# Altium schematic sheet Rail_2.SchDoc: Half Bridge 2
size A4; DocumentNumber: 4; Revision: 1.1; SheetNumber: 4; SheetTotal: 6
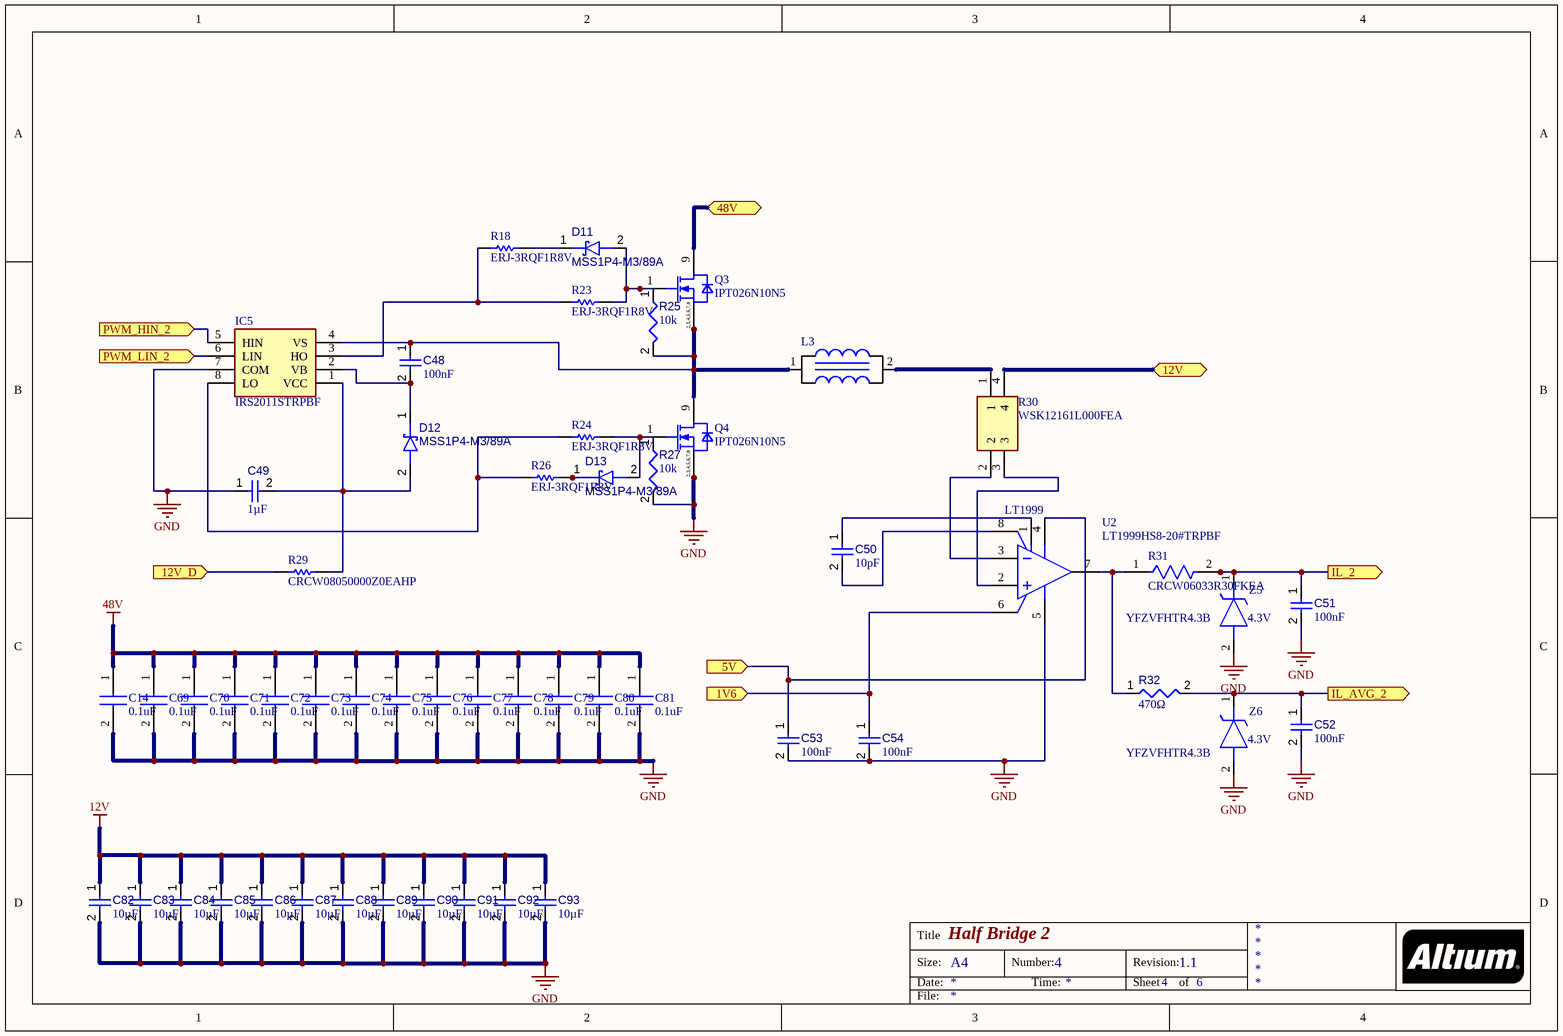
[diagram p0: Rail_2.SchDoc]

## Parts
C14  0.1uF  [CAPC1608X90N]
C48  value 100nF  [CAPC1608X90X40ML10T20]  (hidden comment: Capacitor 100 nF +/-10% 50 V 0603)
C49  value 1µF  [CAPC0603(1608)100_L]  (hidden comment: Capacitor 1µF +/-0.1% 25V 0603)
C50  value 10pF  [CAPC1608X87X35ML15T15]  (hidden comment: Capacitor 10 pF +/- 0.25 pF 50 V 0603)
C51  value 100nF  [CAPC1608X90X40ML10T20]  (hidden comment: Capacitor 100 nF +/-10% 50 V 0603)
C52  value 100nF  [CAPC1608X90X40ML10T20]  (hidden comment: Capacitor 100 nF +/-10% 50 V 0603)
C53  value 100nF  [CAPC1608X90X40ML10T20]  (hidden comment: Capacitor 100 nF +/-10% 50 V 0603)
C54  value 100nF  [CAPC1608X90X40ML10T20]  (hidden comment: Capacitor 100 nF +/-10% 50 V 0603)
C69  0.1uF  [CAPC1608X90N]
C70  0.1uF  [CAPC1608X90N]
C71  0.1uF  [CAPC1608X90N]
C72  0.1uF  [CAPC1608X90N]
C73  0.1uF  [CAPC1608X90N]
C74  0.1uF  [CAPC1608X90N]
C75  0.1uF  [CAPC1608X90N]
C76  0.1uF  [CAPC1608X90N]
C77  0.1uF  [CAPC1608X90N]
C78  0.1uF  [CAPC1608X90N]
C79  0.1uF  [CAPC1608X90N]
C80  0.1uF  [CAPC1608X90N]
C81  0.1uF  [CAPC1608X90N]
C82  value 10µF  [CAPC0805(2012)145_L]  (hidden comment: Capacitor 10µF +/-20% 25V 0805)
C83  value 10µF  [CAPC0805(2012)145_L]  (hidden comment: Capacitor 10µF +/-20% 25V 0805)
C84  value 10µF  [CAPC0805(2012)145_L]  (hidden comment: Capacitor 10µF +/-20% 25V 0805)
C85  value 10µF  [CAPC0805(2012)145_L]  (hidden comment: Capacitor 10µF +/-20% 25V 0805)
C86  value 10µF  [CAPC0805(2012)145_L]  (hidden comment: Capacitor 10µF +/-20% 25V 0805)
C87  value 10µF  [CAPC0805(2012)145_L]  (hidden comment: Capacitor 10µF +/-20% 25V 0805)
C88  value 10µF  [CAPC0805(2012)145_L]  (hidden comment: Capacitor 10µF +/-20% 25V 0805)
C89  value 10µF  [CAPC0805(2012)145_L]  (hidden comment: Capacitor 10µF +/-20% 25V 0805)
C90  value 10µF  [CAPC0805(2012)145_L]  (hidden comment: Capacitor 10µF +/-20% 25V 0805)
C91  value 10µF  [CAPC0805(2012)145_L]  (hidden comment: Capacitor 10µF +/-20% 25V 0805)
C92  value 10µF  [CAPC0805(2012)145_L]  (hidden comment: Capacitor 10µF +/-20% 25V 0805)
C93  value 10µF  [CAPC0805(2012)145_L]  (hidden comment: Capacitor 10µF +/-20% 25V 0805)
D11  MSS1P4-M3/89A  [MicroSMP (DO-219AD)]
D12  MSS1P4-M3/89A  [MicroSMP (DO-219AD)]
D13  MSS1P4-M3/89A  [MicroSMP (DO-219AD)]
IC5  IRS2011STRPBF  [SOIC127P600X175-8N-12-V]
L3  Inductor (Ansys)  [Inductor-Footprint-1]  (value not drawn)
Q3  IPT026N10N5  [INF-PG-HSOF-8-1-0-V]
Q4  IPT026N10N5  [INF-PG-HSOF-8-1-0-V]
R18  ERJ-3RQF1R8V  [RESC1608X55X30LL15T15]
R23  ERJ-3RQF1R8V  [RESC1608X55X30LL15T15]
R24  ERJ-3RQF1R8V  [RESC1608X55X30LL15T15]
R25  value 10k  [RESC1608X55X25ML10T15]  (hidden comment: Resistor 10k +/-1% 0603 100 mW)
R26  ERJ-3RQF1R8V  [RESC1608X55X30LL15T15]
R27  value 10k  [RESC1608X55X25ML10T15]  (hidden comment: Resistor 10k +/-1% 0603 100 mW)
R29  CRCW08050000Z0EAHP  [RESC2013X50X30ML20T20]
R30  WSK12161L000FEA  [WSK12161L000FEA]
R31  CRCW06033R30FKEA  [FP-CRCW0603-e3-IPC_C]
R32  value 470Ω  [RESC0805(2012)_L]  (hidden comment: 470R5J)
U2  LT1999HS8-20#TRPBF  [LT-S8-8_L]
Z5  YFZVFHTR4.3B  [YFZVFHTR43B]
Z6  YFZVFHTR4.3B  [YFZVFHTR43B]

## Ports
1V6 (in), 5V (in), 12V (bidir), 12V_D (in), 48V (bidir), IL_2 (out), IL_AVG_2 (out), PWM_HIN_2 (in), PWM_LIN_2 (in)

## Nets
12V: C82.1 C83.1 C84.1 C85.1 C86.1 C87.1 C88.1 C89.1 C90.1 C91.1 C92.1 C93.1
48V: C14.1 C69.1 C70.1 C71.1 C72.1 C73.1 C74.1 C75.1 C76.1 C77.1 C78.1 C79.1 C80.1 C81.1
GND: C14.2 C49.1 C51.2 C52.2 C53.2 C54.2 C69.2 C70.2 C71.2 C72.2 C73.2 C74.2 C75.2 C76.2 C77.2 C78.2 C79.2 C80.2 C81.2 C82.2 C83.2 C84.2 C85.2 C86.2 C87.2 C88.2 C89.2 C90.2 C91.2 C92.2 C93.2 IC5.7(COM) Q4.2(SOURCE) Q4.3(SOURCE) Q4.4(SOURCE) Q4.5(SOURCE) Q4.6(SOURCE) Q4.7(SOURCE) Q4.8(SOURCE) R27.2 U2.5(GND) Z5.2(A) Z6.2(A)
1V6: C54.1 U2.6(REF) ; port 1V6
5V: C53.1 U2.4(V+) ; port 5V
12V: R30.4 ; port 12V  [a separate net that carries the same name]
12V_D: R29.1 ; port 12V_D
48V: Q3.9(DRAIN) ; port 48V  [a separate net that carries the same name]
IL_2: C51.1 R31.2 Z5.1(K) ; port IL_2
IL_AVG_2: C52.1 R32.2 Z6.1(K) ; port IL_AVG_2
PWM_HIN_2: IC5.5(HIN) ; port PWM_HIN_2
PWM_LIN_2: IC5.6(LIN) ; port PWM_LIN_2
NetC48_1: C48.1 IC5.4(VS) L3.1 Q3.2(SOURCE) Q3.3(SOURCE) Q3.4(SOURCE) Q3.5(SOURCE) Q3.6(SOURCE) Q3.7(SOURCE) Q3.8(SOURCE) Q4.9(DRAIN) R25.2
NetC48_2: C48.2 D12.1(K) IC5.2(VB)
NetC49_2: C49.2 D12.2(A) IC5.1(VCC) R29.2
NetC50_1: C50.1 U2.1(V+)
NetC50_2: C50.2 U2.8(~{SHDN})
NetD11_1: D11.1(K) R18.2
NetD11_2: D11.2(A) Q3.1(GATE) R23.2 R25.1
NetD13_1: D13.1(K) R26.2
NetD13_2: D13.2(A) Q4.1(GATE) R24.2 R27.1
NetIC5_3: IC5.3(HO) R18.1 R23.1
NetIC5_8: IC5.8(LO) R24.1 R26.1
NetL3_2: L3.2 R30.1
NetR30_2: R30.2 U2.3(-IN)
NetR30_3: R30.3 U2.2(+IN)
NetR31_1: R31.1 R32.1 U2.7(OUT)

## Notes on the sheet
- (near U2) LT1999
- (near Z5) 4.3V
- (near Z6) 4.3V
- Title
- Size:
- Date:
- A4
- Number:
- Time:
- Revision:
- Sheet
- of
- File:
- (in symbol IPT026N10N5) 2,3,4,5,6,7,8

## Library data of the parts
C14 C69-C81 = 06031C104K4T2A: Capacitor; Manufacturer_Name: AVX; Datasheet Link: https://componentsearchengine.com/Datasheets/1/06031A100FAT2A.pdf; Height: 0.9mm; Manufacturer_Part_Number: 06031C104K4T2A; Mouser Part Number: 581-06031C104K4T2A; Mouser Price/Stock: https://www.mouser.co.uk/ProductDetail/AVX/06031C104K4T2A?qs=7MVldsJ5UaycASOsZ6%2FbJQ%3D%3D
C48 C51-C54 = CMP-001-00017-4: Chip Capacitor, 100 nF, +/- 10%, 50 V, 0603 (1608 Metric); Capacitor Type: Ceramic; Voltage Rating: 50V; RoHS Compliant: True; Max Operating Temperature: 125°C; Pins: 2; Mounting Technology: SM; Min Operating Temperature: -55°C; Tolerance: 10%; Case/Package: 0603
C49 = CMP-001-00055-2: Chip Capacitor, 1µF +/-0.1%, 25V, 0603, Thickness 1 mm; Tolerance: 20%; Max Operating Temperature: 85°C; Voltage Rating: 25V; Min Operating Temperature: -55°C; Case/Package: 0805; Mounting Technology: SMT; Pins: 2
C50 = CMP-001-00012-4: Chip Capacitor, 10 pF, +/- 0.25 pF, 50 V, 0603 (1608 Metric); Tolerance: 0.25%; Capacitor Type: Ceramic; Voltage Rating: 50V; Min Operating Temperature: -55°C; Mounting Technology: SM; RoHS Compliant: True; Case/Package: 0603; Pins: 2; Max Operating Temperature: 125°C
C82-C93 = CMP-001-00079-2: Chip Capacitor, 10µF +/-20%, 25V, 0805, Thickness 1.45 mm; Tolerance: 10%; Pins: 2; Max Operating Temperature: 85°C; Mounting Technology: SMT; Case/Package: 0603; Voltage Rating: 25V; Min Operating Temperature: -55°C
D11-D13 = CMP-004-00024-2: Schottky Diodes & Rectifiers 1.0 Amp 40 Volt; Max Surge Current: 25A; Forward Voltage: 460mV; Pins: 2; Min Operating Temperature: -55°C; Max Operating Temperature: 150°C; Mounting Technology: SMT
IC5 = IRS2011STRPBF: Integrated Circuit; Manufacturer_Name: Infineon; Datasheet Link: https://componentsearchengine.com/Datasheets/1/IRS2011STRPBF.pdf; Height: 1.75mm; Manufacturer_Part_Number: IRS2011STRPBF; Arrow Part Number: IRS2011STRPBF; Arrow Price/Stock: https://www.arrow.com/en/products/irs2011strpbf/infineon-technologies-ag; Mouser Part Number: 942-IRS2011STRPBF; Mouser Price/Stock: https://www.mouser.co.uk/ProductDetail/Infineon-IR/IRS2011STRPBF?qs=9%252BKlkBgLFf3Y4ge8A0TwYQ%3D%3D
L3 = CMP-006-00021-3: Ansys 3D Model
Q3 Q4 = IPT026N10N5: Insulated-Gate Field-Effect Transistor (IGFET), N-Channel, Enhancement, Body Diode, Pin 1 Gate, 2-8 Source, 9 Drain, 9 Pins; Manufacturer: Infineon Technologies; PackageReference: PG-HSOF-8-1; ManufacturerPartNumber: IPT026N10N5
R18 R23 R24 R26 = CMP-2000-00844-1: Manufacturer: Panasonic; Part Number: ERJ-3RQF1R8V
R25 R27 = CMP-009-00017-4: Chip Resistor, 10 KOhm, +/- 1%, 01 W, -55 to 155 degC, 0603 (1608 Metric); Voltage Rating: 50V; Power: 100mW; Min Operating Temperature: -55°C; Tolerance: 1%; Case/Package: 0603; Pins: 2; Max Operating Temperature: 155°C; RoHS Compliant: True; Mounting Technology: SM
R29 = CMP-2001-04185-1: Manufacturer: Vishay Dale; Part Number: CRCW08050000Z0EAHP
R30 = WSK12161L000FEA: Resistor; Manufacturer_Name: Vishay; Datasheet Link: http://www.vishay.com/docs/30189/wsk1216.pdf; Height: 1.9mm; Manufacturer_Part_Number: WSK12161L000FEA; Arrow Part Number: WSK12161L000FEA; Arrow Price/Stock: https://www.arrow.com/en/products/wsk12161l000fea/vishay; Mouser Part Number: 71-WSK12161L000FEA; Mouser Price/Stock: https://www.mouser.co.uk/ProductDetail/Vishay-Dale/WSK12161L000FEA?qs=jj7GbYRQuOayzWPPW7c8og%3D%3D
R31 = CMP-1012-00228-3: RES Thick Film, 3.3Ω, 1%, 0.1W, 100ppm/°C, 0603; Resistance: 3.3R; Max Power Dissipation: 100mW; Voltage Rating: 75V; Case Code (Imperial): 0603; Width: 0.85mm; Number of Terminations: 2; REACH SVHC: No SVHC; Case/Package: 0603; Package Quantity: 10; Radiation Hardening: No; Min Operating Temperature: -55°C; Max Operating Temperature: 155°C; Composition: Thick Film; Termination: SMD/SMT; Tolerance: 1%; Military Standard: Not; Weight: 7.1E-05oz; Contact Plating: Tin; Packaging: Tape and Reel; Power Rating: 100mW; Height: 0.02inch; Length: 1.55mm; Voltage Rating (DC): 75V; Temperature Coefficient: 100ppm/°C; Case Code (Metric): 1608; Depth: 0.85mm; Lead Free: Lead Free; Features: Automotive AEC-Q200
R32 = CMP-009-00102-1: 470R 0.125W 5% 0805 (2012 Metric)  SMD; Power: 0.125W; Tolerance: 5%; Mounting Technology: SMT; Case/Package: 0805; Pins: 2
U2 = CMP-0359-03344-2: Single Channel, High Voltage, Bidirectional Current Sense Amplifier, 2 MHz Typical GBW, 3 V/us Typical SR, 4.5 to 5.5 V, 8-Pin SOIC (S8-8), High Temperature / Automotive, Pb-Free, Reel; Linear Technology Part Number: LT1999-20; Manufacturer: Linear Technology; Channels (#): 1; GBW (MHz) Typical: 2; Is (mA) Typical: 1.55; Vs Max (V): 5.5; SR (V/us) Typical: 3; Vos (mV) Typical: 0.5; Vs Min (V): 4.5; ComponentLink2Description: Datasheet; RoHS: Pb-Free; ComponentLink1URL: http://www.linear.com/; Type: CSA; DatasheetVersion: Rev. B; ComponentLink3URL: http://cds.linear.com/docs/en/packaging/05081610_G_SO8.pdf; ComponentLink1Description: Manufacturer URL; PackageReference: LT-S8-8; PackageVersion: Rev G; PartNumber: LT1999HS8-20#TRPBF; RevisionNote: URLs updated; Packing: Reel; PackageDescription: 8-Pin Plastic Small Outline, Body 4.9 x 3.9 mm, Pitch 1.27 mm; ComponentLink3Description: Package Specification; Mounting Technology: Surface Mount; ComponentLink2URL: http://cds.linear.com/docs/en/datasheet/1999fb.pdf
Z5 Z6 = YFZVFHTR4.3B: Zener Diode; Manufacturer_Name: ROHM Semiconductor; Datasheet Link: https://componentsearchengine.com/Datasheets/2/YFZVFHTR4.3B.pdf; Height: 0.8mm; Manufacturer_Part_Number: YFZVFHTR4.3B; Mouser Part Number: 755-YFZVFHTR4.3B; Mouser Price/Stock: https://www.mouser.co.uk/ProductDetail/ROHM-Semiconductor/YFZVFHTR43B?qs=4v%252BiZTmLVHGVnMzHBrJLew%3D%3D